# Altium schematic sheet CURRENT_SENSOR.SchDoc
size A
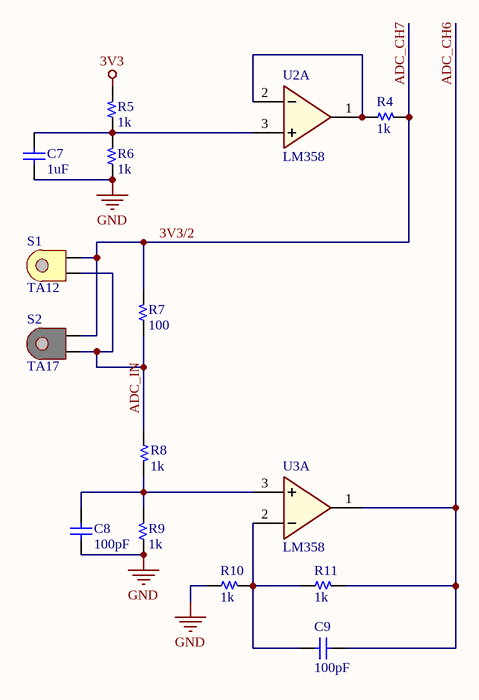
[diagram p0: CURRENT_SENSOR.SchDoc]

## Parts
C7  1uF  [C 1206]
C8  100pF  [C 1206]
C9  100pF  [C 1206]
R4  1k  [R 0603]
R5  1k  [R 0603]
R6  1k  [R 0603]
R7  100  [R 0603]
R8  1k  [R 0603]
R9  1k  [R 0603]
R10  1k  [R 0603]
R11  1k  [R 0603]
S1  TA12  [TA12]
S2  TA17  [TA17]
U2  LM358  [SOIC-8]  (part A of 2)
U3  LM358  [SOIC-8]  (part A of 2)

## Nets
3V3: R5.2
GND: C7.2 C8.2 R6.1 R9.1 R10.1 U2.4(GND) U3.4(GND)
VCC: U2.8(VCC) U3.8(VCC)
3V3/2: R4.2 R7.2 S1.1 S2.1  [also labelled ADC_CH7]
ADC_CH6: C9.2 R11.2 U3.1(OutA)
ADC_IN: R7.1 R8.1 S1.2 S2.2
NetC7_1: C7.1 R5.1 R6.2 U2.3(A+)
NetC8_1: C8.1 R8.2 R9.2 U3.3(A+)
NetC9_1: C9.1 R10.2 R11.1 U3.2(A-)
NetR4_1: R4.1 U2.1(OutA) U2.2(A-)

## Library data of the parts
C7-C9 = Capacitor NP: Capacitor non-pol
R4-R11 = Resistor
U2 U3 = LM358: Low Power Dual Operational Amplifiers